# Altium schematic sheet Main.SchDoc
size A4
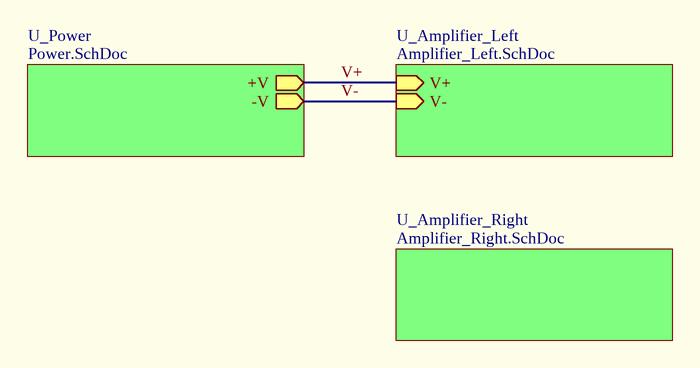
[diagram p0: Main.SchDoc]

## Sub-sheets
U_Amplifier_Left = Amplifier_Left.SchDoc: V+ (in), V- (in)
U_Amplifier_Right = Amplifier_Right.SchDoc: no entries
U_Power = Power.SchDoc: +V (out), -V (out)

## Nets
V+: sheet U_Power/+V, sheet U_Amplifier_Left/V+
V-: sheet U_Power/-V, sheet U_Amplifier_Left/V-